# Altium schematic sheet Buck-Boost Controller.SchDoc
size A
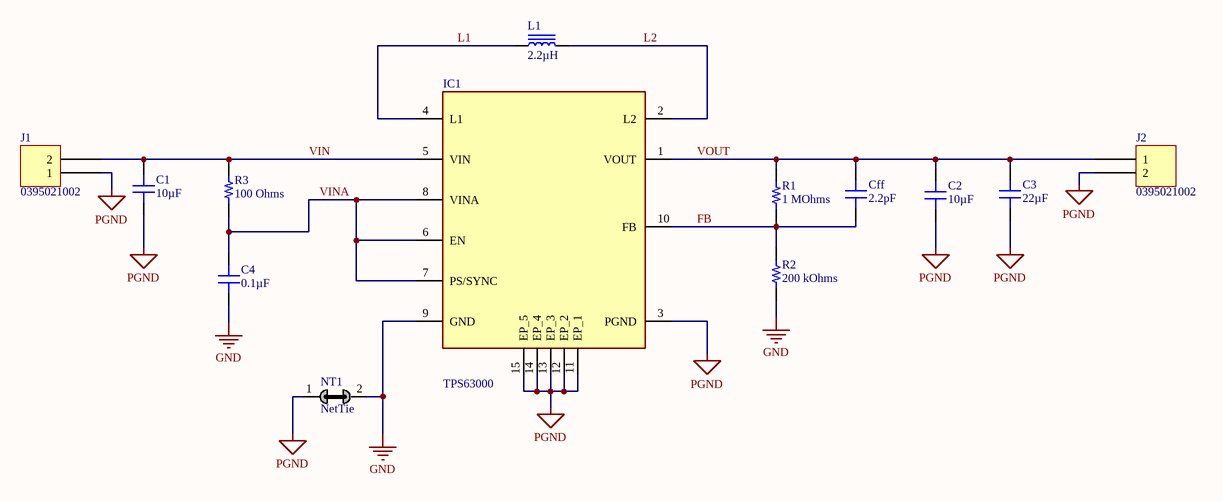
[diagram p0: Buck-Boost Controller.SchDoc]

## Parts
C1  10µF  [CAP 0805_2012]
C2  10µF  [CAP 0805_2012]
C3  22µF  [CAP 0805_2012]
C4  0.1µF  [CAP 0805_2012]
Cff  2.2pF  [CAP 0805_2012]
IC1  TPS63000  [TPS63002DRCR]
J1  0395021002  [MOLEX 395021002]
J2  0395021002  [MOLEX 395021002]
L1  2.2µH  [MURATA LQH31]
NT1  NetTie  [NetTie_Narrow2]  (net tie, no BOM)
R1  1 MOhms  [RES 0805_2012]
R2  200 kOhms  [RES 0805_2012]
R3  100 Ohms  [RES 0805_2012]

## Nets
GND: C4.1 IC1.9(GND) NT1.2 R2.1
PGND: C1.1 C2.1 C3.1 IC1.3(PGND) IC1.11(EP_1) IC1.12(EP_2) IC1.13(EP_3) IC1.14(EP_4) IC1.15(EP_5) J1.1 J2.2 NT1.1
FB: Cff.1 IC1.10(FB) R1.1 R2.2
L1: IC1.4(L1) L1.1
L2: IC1.2(L2) L1.2
VIN: C1.2 IC1.5(VIN) J1.2 R3.2
VINA: C4.2 IC1.6(EN) IC1.7(PS/SYNC) IC1.8(VINA) R3.1
VOUT: C2.2 C3.2 Cff.2 IC1.1(VOUT) J2.1 R1.2

## Library data of the parts
C1 C2 = C2012X7R1A106M125AC: CAP CER 10UF 10V X7R 0805; Manufacturer: TDK Corporation; Tolerance: ±20%; Part Number: C2012X7R1A106M125AC; Value: 10µF; Applications: General Purpose; Capacitance: 10µF; ComponentLink1Description: Datasheet; ComponentLink1URL: https://product.tdk.com/info/en/catalog/datasheets/mlcc_commercial_general_en.pdf?ref_disty=digikey; ComponentLink2Description: DigiKey Link; ComponentLink2URL: http://digikey.com/product-detail/en/tdk-corporation/C2012X7R1A106M125AC/445-7592-1-ND/2733664; Device Package: 0805 (2012 Metric); Features: Low ESL; LastUpdated: 8/29/2020 11:47:30 PM; Lifecycle Status: Active; Minimum Order: 1; Mounting Type: Surface Mount, MLCC; Operating Temperature: -55°C ~ 125°C; Package / Case: 0805 (2012 Metric); Packaging: TapeAndReel; PartId: 2994; Part Status: Active; Price: 0.09; Series: C; Size / Dimension: 0.079" L x 0.049" W (2.00mm x 1.25mm); Supplier 1: DigiKey; Supplier Part Number 1: 445-7592-1-ND; Temperature Coefficient: X7R; Thickness (Max): 0.057" (1.45mm)
C3 = CL21A226MPCLRNC: CAP CER 22UF 10V X5R 0805; Manufacturer: Samsung Electro-Mechanics; Tolerance: ±20%; Part Number: CL21A226MPCLRNC; Value: 22µF; Applications: General Purpose; Capacitance: 22µF; ComponentLink1Description: Datasheet; ComponentLink1URL: http://www.samsungsem.com/kr/support/product-search/mlcc/CL21A226MPCLRNC.jsp; ComponentLink2Description: DigiKey Link; ComponentLink2URL: http://digikey.com/product-detail/en/samsung-electro-mechanics/CL21A226MPCLRNC/1276-1822-1-ND/3889908; Device Package: 0805 (2012 Metric); LastUpdated: 8/29/2020 11:47:23 PM; Lifecycle Status: Active; Minimum Order: 1; Mounting Type: Surface Mount, MLCC; Operating Temperature: -55°C ~ 85°C; Package / Case: 0805 (2012 Metric); Packaging: TapeAndReel; PartId: 7485; Part Status: Active; Price: 0.10; Series: CL; Size / Dimension: 0.079" L x 0.049" W (2.00mm x 1.25mm); Supplier 1: DigiKey; Supplier Part Number 1: 1276-1822-1-ND; Temperature Coefficient: X5R; Thickness (Max): 0.037" (0.95mm)
C4 = GCM21BR91H104KA37L: CAP CER 0.1UF 50V X8R 0805; Manufacturer: Murata Electronics; Tolerance: ±10%; Part Number: GCM21BR91H104KA37L; Value: 0.1µF; Applications: Automotive; Capacitance: 0.1µF; ComponentLink1Description: Datasheet; ComponentLink1URL: https://www.murata.com/~/media/webrenewal/support/library/catalog/products/capacitor/mlcc/c03e.ashx?la=en-us; ComponentLink2Description: DigiKey Link; ComponentLink2URL: http://digikey.com/product-detail/en/murata-electronics/GCM21BR91H104KA37L/490-11165-1-ND/5333005; Device Package: 0805 (2012 Metric); LastUpdated: 8/29/2020 11:47:12 PM; Lifecycle Status: Active; Minimum Order: 1; Mounting Type: Surface Mount, MLCC; Operating Temperature: -55°C ~ 150°C; Package / Case: 0805 (2012 Metric); Packaging: TapeAndReel; PartId: 12788; Part Status: Active; Price: 0.07; Ratings: AEC-Q200; Series: GCM; Size / Dimension: 0.079" L x 0.049" W (2.00mm x 1.25mm); Supplier 1: DigiKey; Supplier Part Number 1: 490-11165-1-ND; Temperature Coefficient: X8R; Thickness (Max): 0.055" (1.40mm)
Cff = C0805C229C1GAC7800: CAP CER 2.2PF 100V NP0 0805; Manufacturer: KEMET; Temperature Coefficient: C0G, NP0; Tolerance: ±0.25pF; Part Number: C0805C229C1GAC7800; Value: 2.2pF; Applications: General Purpose; Capacitance: 2.2pF; ComponentLink1Description: Datasheet; ComponentLink1URL: https://api.kemet.com/component-edge/download/datasheet/C0805C229C1GACTU.pdf; ComponentLink2Description: DigiKey Link; ComponentLink2URL: http://digikey.com/product-detail/en/kemet/C0805C229C1GAC7800/399-14578-1-ND/7103870; Device Package: 0805 (2012 Metric); Features: Low ESL; LastUpdated: 8/29/2020 11:47:20 PM; Lifecycle Status: Active; Minimum Order: 1; Mounting Type: Surface Mount, MLCC; Operating Temperature: -55°C ~ 125°C; Package / Case: 0805 (2012 Metric); Packaging: TapeAndReel; PartId: 8962; Part Status: Active; Price: 0.09; Series: SMD Comm C0G; Size / Dimension: 0.079" L x 0.049" W (2.00mm x 1.25mm); Supplier 1: DigiKey; Supplier Part Number 1: 399-14578-1-ND; Thickness (Max): 0.035" (0.88mm)
IC1 = TPS63000DRCR: Switching Regulator, Current-mode, 2A, 1500kHz Switching Freq-Max, PDSO10; Manufacturer_Name: Texas Instruments; Output Voltage: 5.5V; Output Current: 1.2A; Switching Frequency: 1.5MHz; Number of Outputs: 1; Min Input Voltage: 1.8V; Synchronous Rectifier: Yes; Quiescent Current: 40uA; Output Type: Adjustable; Min Output Voltage: 1.2V; Efficiency: 96%; Topology: Buck-Boost; Datasheet Link: https://www.ti.com/lit/gpn/TPS63002; Height: 1mm; Manufacturer_Part_Number: TPS63002DRCR; Arrow Part Number: TPS63002DRCR; Arrow Price/Stock: https://www.arrow.com/en/products/tps63002drcr/texas-instruments; Mouser Part Number: 595-TPS63002DRCR; Mouser Price/Stock: https://www.mouser.co.uk/ProductDetail/Texas-Instruments/TPS63002DRCR?qs=QZuYiDxzHagvx6A2KHyUrA%3D%3D; Supplier 1: Digi-Key; Supplier Part Number 1: 296-19641-1-ND; Manufacturer: Texas Instruments; Manufacturer Part Number: TPS63000DRCR; RoHS: Yes; Category: Voltage Regulators - Switching; Stock 1: 48373; Pricing 1: 1=2.21000, 10=1.98200, 25=1.87000, 100=1.49600, 250=1.30900, 500=1.27160, 1000=1.00980 (USD); Number of Pins: 10; Weight: 0.000921oz; Min Operating Temperature: -40°C; Max Operating Temperature: 85°C; Package Quantity: 1; Packaging: Tape and Reel; Max Output Current: 1.2A; Max Input Voltage: 5.5V; Max Output Voltage: 5.5V; Operating Supply Voltage: 5.5V; Radiation Hardening: No; Lead Free: Lead Free; REACH SVHC: No SVHC; ComponentLink1URL: https://www.ti.com:443/lit/ds/symlink/tps63000.pdf?src-supplier=IHS+Markit; ComponentLink1Description: https://www.ti.com:443/lit/ds/symlink/tps63000.pdf?src-supplier=IHS+Markit; ComponentLink2URL: https://datasheet.ciiva.com/2025/tps63001-2025809.pdf?src-supplier=Digi-Key; ComponentLink2Description: https://datasheet.ciiva.com/2025/tps63001-2025809.pdf?src-supplier=Digi-Key; ComponentLink3URL: https://datasheet.ciiva.com/15113/getdatasheetpartid-252007-15113893.pdf?src-supplier=Verical; ComponentLink3Description: https://datasheet.ciiva.com/15113/getdatasheetpartid-252007-15113893.pdf?src-supplier=Verical; ComponentLink4URL: https://datasheet.ciiva.com/27052/1525749-27052325.pdf?src-supplier=Jameco; ComponentLink4Description: https://datasheet.ciiva.com/27052/1525749-27052325.pdf?src-supplier=Jameco; ComponentLink5URL: https://datasheet.ciiva.com/41462/001014937-da-01-en-ic-reg-buck-boo-tps63000drcr-vson-10-tid-41462784.pdf?src-supplier=Conrad; ComponentLink5Description: https://datasheet.ciiva.com/41462/001014937-da-01-en-ic-reg-buck-boo-tps63000drcr-vson-10-tid-41462784.pdf?src-supplier=Conrad; ComponentLink6URL: https://datasheet.ciiva.com/26896/tps63000drcr-26896660.pdf?src-supplier=IIIC; ComponentLink6Description: https://datasheet.ciiva.com/26896/tps63000drcr-26896660.pdf?src-supplier=IIIC; ComponentLink7URL: https://datasheet.ciiva.com/2025/tps63001-2025810.pdf?src-supplier=Digi-Key; ComponentLink7Description: https://datasheet.ciiva.com/2025/tps63001-2025810.pdf?src-supplier=Digi-Key; ComponentLink8URL: https://datasheet.ciiva.com/2025/tps63001-2025811.pdf?src-supplier=Digi-Key; ComponentLink8Description: https://datasheet.ciiva.com/2025/tps63001-2025811.pdf?src-supplier=Digi-Key
J1 J2 = 0395021002: TERM BLOCK HDR 2POS 90DEG 3.5MM; Manufacturer: Molex; Current - UL: 8A; Header Orientation: 90°, Right Angle; Number of Levels: 1; Number of Positions: 2; Pitch: 0.138" (3.50mm); Voltage - UL: 300V; Part Number: 0395021002; Color: Black; ComponentLink1Description: Datasheet; ComponentLink1URL: https://www.molex.com/pdm_docs/sd/395021002_sd.pdf; ComponentLink2Description: DigiKey Link; ComponentLink2URL: http://digikey.com/product-detail/en/molex/0395021002/WM7770-ND/1280621; Contact Mating Finish: Tin; LastUpdated: 6/25/2020 3:44:05 PM; Lifecycle Status: Active; Minimum Order: 1; Mounting Type: Through Hole; Operating Temperature: -40°C ~ 105°C; Packaging: Tray; Part Status: Active; Positions Per Level: 2; Price: 0.58; Series: Eurostyle ESE 39502; Supplier 1: DigiKey; Supplier Part Number 1: WM7770-ND; Termination Style: Solder; Type: Header, Male Pins, Shrouded (4 Side)
L1 = LQH31CN2R2M03L: FIXED IND 2.2UH 430MA 410 MOHM; Manufacturer: Murata Electronics; DC Resistance (DCR): 533mOhm Max; Frequency - Self Resonant: 50MHz; Inductance Frequency - Test: 1MHz; Material - Core: 1206 (3216 Metric); Shielding: Unshielded; Tolerance: ±20%; Type: Wirewound; Part Number: LQH31CN2R2M03L; ComponentLink1Description: Datasheet; ComponentLink1URL: https://search.murata.co.jp/Ceramy/image/img/P02/JELF243A-0031.pdf; ComponentLink2Description: DigiKey Link; ComponentLink2URL: http://digikey.com/product-detail/en/murata-electronics/LQH31CN2R2M03L/490-8392-1-ND/4380691; Current Rating (Amps): 430mA; Device Package: 1206 (3216 Metric); Height - Seated (Max): 0.079" (2.00mm); Inductance: 2.2µH; LastUpdated: 8/30/2020 12:20:20 AM; Lifecycle Status: Active; Minimum Order: 1; Mounting Type: Surface Mount; Operating Temperature: -40°C ~ 85°C; Package / Case: 1206 (3216 Metric); Packaging: TapeAndReel; PartId: 3599; Part Status: Active; Price: 0.29; Series: LQH31; Size / Dimension: 0.126" L x 0.063" W (3.20mm x 1.60mm); Supplier 1: DigiKey; Supplier Part Number 1: 490-8392-1-ND; Supplier Device Package: 1206; Value: 2.2µH
R1 = CRCW08051M00FKEB: RES SMD 1M OHM 1% 1/8W 0805; Manufacturer: Vishay Dale; Power (Watts): 0.125W, 1/8W; Temperature Coefficient: ±100ppm/°C; Part Number: CRCW08051M00FKEB; Value: 1 MOhms; ComponentLink1Description: Datasheet; ComponentLink1URL: http://www.vishay.com/docs/20035/dcrcwe3.pdf; ComponentLink2Description: DigiKey Link; ComponentLink2URL: http://digikey.com/product-detail/en/vishay-dale/CRCW08051M00FKEB/541-CRCW08051M00FKEBCT-ND/11500801; Composition: Thick Film; Device Package: 0805 (2012 Metric); Features: Automotive AEC-Q200; LastUpdated: 8/29/2020 11:58:00 PM; Lifecycle Status: Active; Minimum Order: 1; Number of Terminations: 2; Operating Temperature: -55°C ~ 155°C; Package / Case: 0805 (2012 Metric); Packaging: TapeAndReel; PartId: 57214; Price: 0.01; Ratings: AEC-Q200; Resistance: 1 MOhms; Series: CRCW; Supplier 1: DigiKey; Supplier Part Number 1: 541-CRCW08051M00FKEBCT-ND; Supplier Device Package: 0805; Tolerance: ±1%
R2 = ERA-6AED204V: RES 200K OHM 0.5% 1/8W 0805; Manufacturer: Panasonic Electronic Components; Power (Watts): 0.125W, 1/8W; Temperature Coefficient: ±25ppm/°C; Part Number: ERA-6AED204V; Value: 200 kOhms; ComponentLink1Description: Datasheet; ComponentLink1URL: https://industrial.panasonic.com/cdbs/www-data/pdf/RDM0000/AOA0000C307.pdf; ComponentLink2Description: DigiKey Link; ComponentLink2URL: http://digikey.com/product-detail/en/panasonic-electronic-components/ERA-6AED204V/P123822CT-ND/9467751; Composition: Thin Film; Device Package: 0805 (2012 Metric); Features: Automotive AEC-Q200; Height - Seated (Max): 0.024" (0.60mm); LastUpdated: 8/29/2020 11:58:26 PM; Lifecycle Status: Active; Minimum Order: 1; Number of Terminations: 2; Operating Temperature: -55°C ~ 155°C; Package / Case: 0805 (2012 Metric); Packaging: TapeAndReel; PartId: 44055; Part Status: Active; Price: 0.01; Ratings: AEC-Q200; Resistance: 200 kOhms; Series: ERA-6A; Size / Dimension: 0.079" L x 0.049" W (2.00mm x 1.25mm); Supplier 1: DigiKey; Supplier Part Number 1: P123822CT-ND; Supplier Device Package: 0805; Tolerance: ±0.5%
R3 = ASC0805-100RF1: RES 100 OHM 1% 1/8W 0805; Manufacturer: Riedon; Power (Watts): 0.125W, 1/8W; Temperature Coefficient: ±100ppm/°C; Part Number: ASC0805-100RF1; Value: 100 Ohms; ComponentLink1Description: Datasheet; ComponentLink1URL: https://riedon.com/media/pdf/ASC.pdf; ComponentLink2Description: DigiKey Link; ComponentLink2URL: http://digikey.com/product-detail/en/riedon/ASC0805-100RF1/696-1783-1-ND/7398753; Composition: Thick Film; Device Package: 0805 (2012 Metric); Features: Anti-Sulfur, Automotive AEC-Q200, Moisture Resistant; Height - Seated (Max): 0.024" (0.60mm); LastUpdated: 8/29/2020 11:58:13 PM; Lifecycle Status: Active; Minimum Order: 1; Number of Terminations: 2; Operating Temperature: -55°C ~ 155°C; Package / Case: 0805 (2012 Metric); Packaging: TapeAndReel; PartId: 47944; Part Status: Active; Price: 0.03; Ratings: AEC-Q200; Resistance: 100 Ohms; Series: ASC; Size / Dimension: 0.079" L x 0.049" W (2.00mm x 1.25mm); Supplier 1: DigiKey; Supplier Part Number 1: 696-1783-1-ND; Supplier Device Package: 0805; Tolerance: ±1%